# Altium schematic sheet Sheet1.SchDoc
size A2
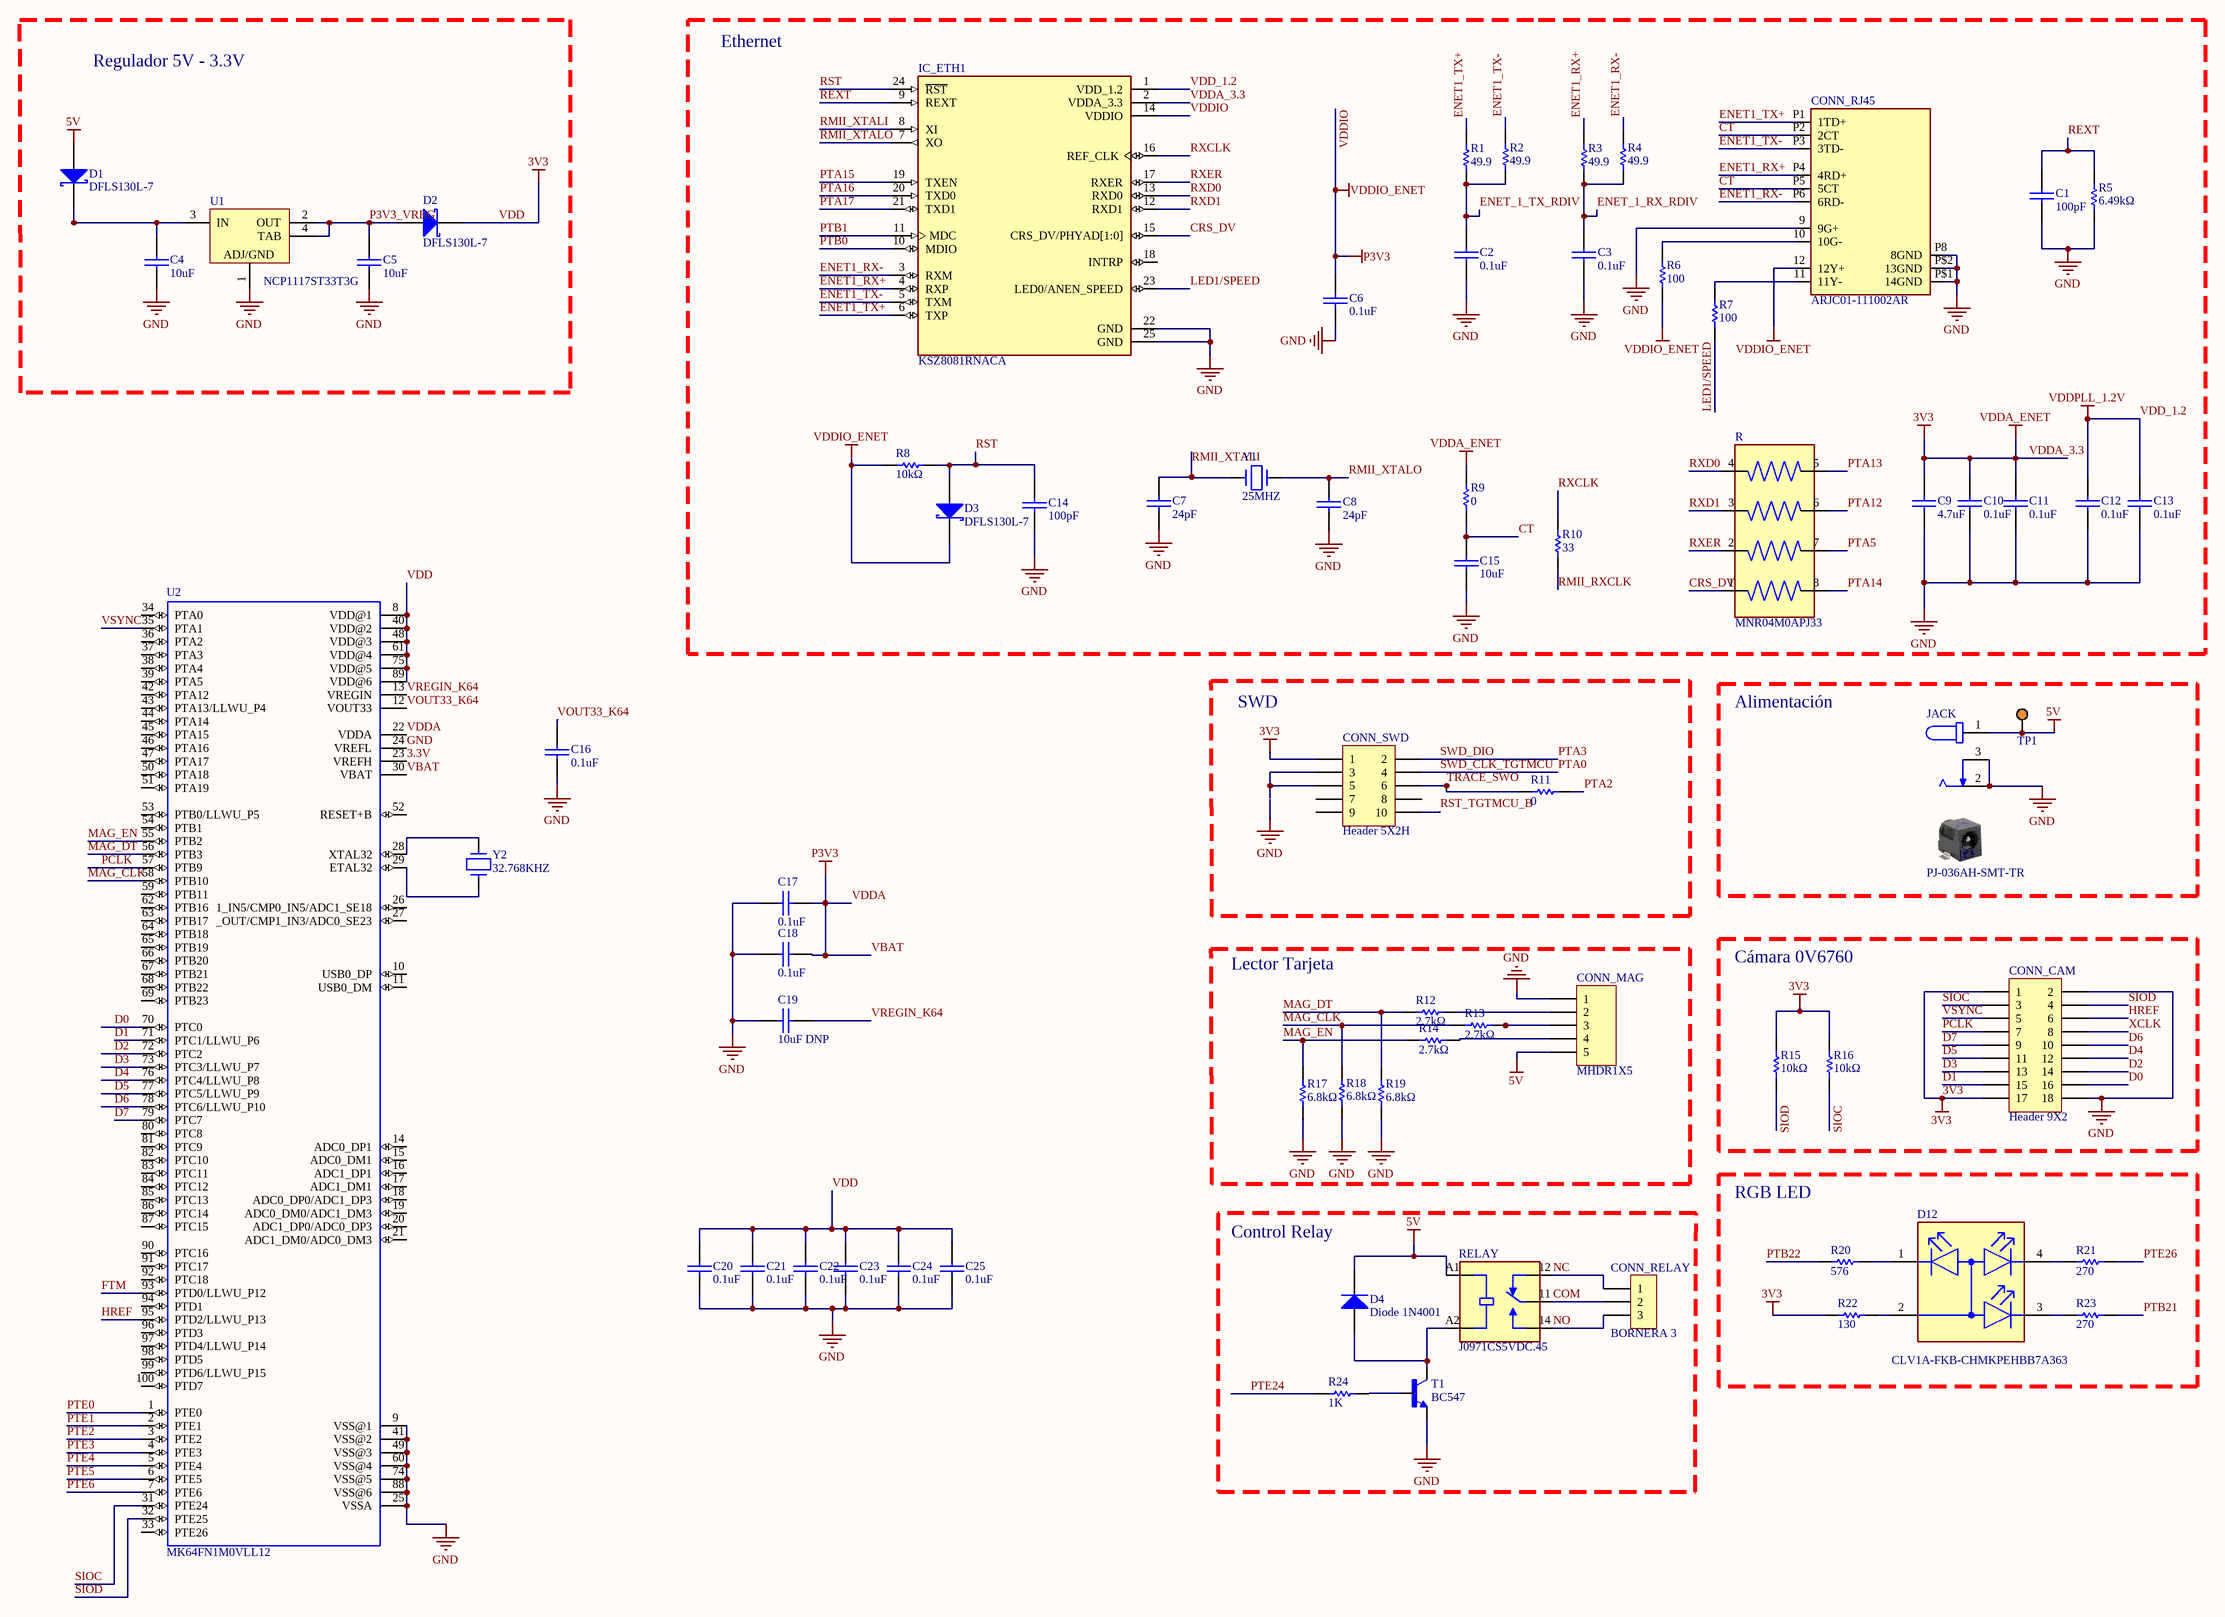
[diagram p0: Sheet1.SchDoc]

## Parts
C1  100pF  [0805]
C2  0.1uF  [0805]
C3  0.1uF  [0805]
C4  10uF  [0805]
C5  10uF  [0805]
C6  0.1uF  [0805]
C7  24pF  [0805]
C8  24pF  [0805]
C9  4.7uF  [0805]
C10  0.1uF  [0805]
C11  0.1uF  [0805]
C12  0.1uF  [0805]
C13  0.1uF  [0805]
C14  100pF  [0805]
C15  10uF  [0805]
C16  0.1uF  [1206]
C17  0.1uF  [0805]
C18  0.1uF  [0805]
C19  10uF DNP  [1206]
C20  0.1uF  [0805]
C21  0.1uF  [0805]
C22  0.1uF  [0805]
C23  0.1uF  [0805]
C24  0.1uF  [0805]
C25  0.1uF  [0805]
CONN_CAM  Header 9X2  [HDR2X9]
CONN_MAG  MHDR1X5  [MHDR1X5]
CONN_RELAY  BORNERA 3  [BORNERA3]
CONN_RJ45  ARJC01-111002AR  [ARJC01-111002AR]
CONN_SWD  Header 5X2H  [HDR2X5H]
D1  DFLS130L-7  [DIOD-POWERDI123-2_A_V]
D2  DFLS130L-7  [DIOD-POWERDI123-2_A_V]
D3  DFLS130L-7  [DIOD-POWERDI123-2_A_V]
D4  Diode 1N4001  [DO-41]
D12  CLV1A-FKB-CHMKPEHBB7A363  [FP-CLV1A-FKB-CHMKPEHBB7A3-MFG]
IC_ETH1  KSZ8081RNACA  [QFN50P400X400X90-25N]
JACK  Manufacturer Part Number: PJ-036AH-SMT-TR  [CUI_PJ-036AH-SMT-TR]  (hidden comment: CONN_JACKDC_SMD_PJ-036AH-SMT-TR)
R  MNR04M0APJ33  [RESCAXS50P200X100X45-8N]
R1  49.9  [0805]
R2  49.9  [0805]
R3  49.9  [0805]
R4  49.9  [0805]
R5  Power: 6.49kΩ  [RES_0603]  (hidden comment: RES_10k_SMD_RMCF0603FT10K0)
R6  100  [0805]
R7  100  [0805]
R8  Power: 10kΩ  [RES_0603]  (hidden comment: RES_10k_SMD_RMCF0603FT10K0)
R9  0  [0805]
R10  Power: 33  [RES_0603]  (hidden comment: RES_10k_SMD_RMCF0603FT10K0)
R11  Power: 0  [RES_0603]  (hidden comment: RES_10k_SMD_RMCF0603FT10K0)
R12  Power: 2.7kΩ  [RES_0603]  (hidden comment: RES_10k_SMD_RMCF0603FT10K0)
R13  Power: 2.7kΩ  [RES_0603]  (hidden comment: RES_10k_SMD_RMCF0603FT10K0)
R14  Power: 2.7kΩ  [RES_0603]  (hidden comment: RES_10k_SMD_RMCF0603FT10K0)
R15  Power: 10kΩ  [RES_0603]  (hidden comment: RES_10k_SMD_RMCF0603FT10K0)
R16  Power: 10kΩ  [RES_0603]  (hidden comment: RES_10k_SMD_RMCF0603FT10K0)
R17  Power: 6.8kΩ  [RES_0603]  (hidden comment: RES_10k_SMD_RMCF0603FT10K0)
R18  Power: 6.8kΩ  [RES_0603]  (hidden comment: RES_10k_SMD_RMCF0603FT10K0)
R19  Power: 6.8kΩ  [RES_0603]  (hidden comment: RES_10k_SMD_RMCF0603FT10K0)
R20  Power: 576  [RES_0603]  (hidden comment: RES_10k_SMD_RMCF0603FT10K0)
R21  Power: 270  [RES_0603]  (hidden comment: RES_10k_SMD_RMCF0603FT10K0)
R22  Power: 130  [RES_0603]  (hidden comment: RES_10k_SMD_RMCF0603FT10K0)
R23  Power: 270  [RES_0603]  (hidden comment: RES_10k_SMD_RMCF0603FT10K0)
R24  1K  [0805]
RELAY  J0971CS5VDC.45  [RELAY_J0971CS5VDC.45]
T1  BC547  [TO92]
TP1  MISC_TESTPOINT  [TP_SIGNAL]  (value not drawn)  (no BOM)
U1  NCP1117ST33T3G  [ONSC-SOT-223-4-318H-01_A_V]
U2  MK64FN1M0VLL12  [QFP50P1600X1600X170-100N]
Y1  25MHZ  [CRISTAL PERFIL]
Y2  32.768KHZ  [CRISTAL PERFIL]

## Blocks framed on the sheet
Regulador 5V - 3.3V: C4 C5 D1 D2 U1
Ethernet: C1-C3 C6-C15 CONN_RJ45 D3 IC_ETH1 R R1-R10 Y1
SWD: CONN_SWD R11
Alimentación: JACK TP1
Lector Tarjeta: CONN_MAG R12-R14 R17-R19
Cámara 0V6760: CONN_CAM R15 R16
RGB LED: D12 R20-R23
Control Relay: CONN_RELAY D4 R24 RELAY T1

## Nets
3V3: C9.1 C10.1 C11.1 C20.2 C21.2 C22.2 C23.2 C24.2 C25.2 CONN_CAM.1 CONN_CAM.17 CONN_SWD.1 D2.2(K) IC_ETH1.2(VDDA_3.3) R9.2 R15.2 R16.2 R22.2 U2.8(VDD@1) U2.40(VDD@2) U2.48(VDD@3) U2.61(VDD@4) U2.75(VDD@5) U2.89(VDD@6)  [also labelled VDD, VDDA_3.3, VDDA_ENET]
5V: CONN_MAG.5 D1.1(A) D4.2(K) JACK.1 RELAY.A1(COIL1) TP1.1
GND: C1.2 C2.1 C3.1 C4.2 C5.2 C6.1 C7.2 C8.2 C9.2 C10.2 C11.2 C12.2 C13.2 C14.1 C15.1 C16.1 C17.1 C18.1 C19.2 C20.1 C21.1 C22.1 C23.1 C24.1 C25.1 CONN_CAM.2 CONN_CAM.18 CONN_MAG.1 CONN_RJ45.9(9G+) CONN_RJ45.P8(8GND) CONN_RJ45.P$1(14GND) CONN_RJ45.P$2(13GND) IC_ETH1.22(GND) IC_ETH1.25(GND) JACK.2 JACK.3 R5.2 R17.2 R18.2 R19.2 T1.1(E) U1.1(ADJ/GND) U2.9(VSS@1) U2.24(VREFL) U2.25(VSSA) U2.41(VSS@2) U2.49(VSS@3) U2.60(VSS@4) U2.74(VSS@5) U2.88(VSS@6)
VBAT: C6.2 C17.2 C18.2 CONN_RJ45.12(12Y+) D3.2(K) IC_ETH1.14(VDDIO) R6.1 R8.2 U2.22(VDDA) U2.30(VBAT)  [also labelled P3V3, VDDA, VDDIO, VDDIO_ENET]
VDD_1.2: C12.1 C13.1 IC_ETH1.1(VDD_1.2)  [also labelled VDDPLL_1.2V]
3.3V: U2.23(VREFH)
COM: CONN_RELAY.2 RELAY.11(COM)
CRS_DV: IC_ETH1.15(CRS_DV/PHYAD[1:0]) R.1
CT: C15.2 CONN_RJ45.P2(2CT) CONN_RJ45.P5(5CT) R9.1
D0: CONN_CAM.16 U2.70(PTC0)
D1: CONN_CAM.15 U2.71(PTC1/LLWU_P6)
D2: CONN_CAM.14 U2.72(PTC2)
D3: CONN_CAM.13 U2.73(PTC3/LLWU_P7)
D4: CONN_CAM.12 U2.76(PTC4/LLWU_P8)
D5: CONN_CAM.11 U2.77(PTC5/LLWU_P9)
D6: CONN_CAM.10 U2.78(PTC6/LLWU_P10)
D7: CONN_CAM.9 U2.79(PTC7)
ENET1_RX+: CONN_RJ45.P4(4RD+) IC_ETH1.4(RXP) R3.2
ENET1_RX-: CONN_RJ45.P6(6RD-) IC_ETH1.3(RXM) R4.2
ENET1_TX+: CONN_RJ45.P1(1TD+) IC_ETH1.6(TXP) R1.2
ENET1_TX-: CONN_RJ45.P3(3TD-) IC_ETH1.5(TXM) R2.2
ENET_1_RX_RDIV: C3.2 R3.1 R4.1
ENET_1_TX_RDIV: C2.2 R1.1 R2.1
FTM: U2.93(PTD0/LLWU_P12)
HREF: CONN_CAM.6 U2.95(PTD2/LLWU_P13)
LED1/SPEED: IC_ETH1.23(LED0/ANEN_SPEED) R7.1
MAG_CLK: R13.2 R18.1 U2.58(PTB10)
MAG_DT: R12.2 R19.1 U2.56(PTB3)
MAG_EN: R14.1 R17.1 U2.55(PTB2)
NC: CONN_RELAY.1 RELAY.12(NC)
NO: CONN_RELAY.3 RELAY.14(NO)
P3V3_VREG: C5.1 D2.1(A) U1.2(OUT) U1.4(TAB)
PCLK: CONN_CAM.7 U2.57(PTB9)
PTA0: CONN_SWD.4  [also labelled SWD_CLK_TGTMCU]
PTA2: R11.1
PTA3: CONN_SWD.2  [also labelled SWD_DIO]
PTA5: R.7
PTA12: R.6
PTA13: R.5
PTA14: R.8
PTA15: IC_ETH1.19(TXEN)
PTA16: IC_ETH1.20(TXD0)
PTA17: IC_ETH1.21(TXD1)
PTB0: IC_ETH1.10(MDIO)
PTB1: IC_ETH1.11(MDC)
PTB21: R23.2
PTB22: R20.2
PTE0: U2.1(PTE0)
PTE1: U2.2(PTE1)
PTE2: U2.3(PTE2)
PTE3: U2.4(PTE3)
PTE4: U2.5(PTE4)
PTE5: U2.6(PTE5)
PTE6: U2.7(PTE6)
PTE24: R24.2
PTE26: R21.2
REXT: C1.1 IC_ETH1.9(REXT) R5.1
RMII_RXCLK: R10.2
RMII_XTALI: C7.1 IC_ETH1.8(XI) Y1.2
RMII_XTALO: C8.1 IC_ETH1.7(XO) Y1.1
RST: C14.2 D3.1(A) IC_ETH1.24(~{RST}) R8.1
RST_TGTMCU_B: CONN_SWD.10
RXCLK: IC_ETH1.16(REF_CLK) R10.1
RXD0: IC_ETH1.13(RXD0) R.4
RXD1: IC_ETH1.12(RXD1) R.3
RXER: IC_ETH1.17(RXER) R.2
SIOC: CONN_CAM.3 R16.1 U2.31(PTE24)
SIOD: CONN_CAM.4 R15.1 U2.32(PTE25)
TRACE_SWO: CONN_SWD.6 R11.2
VOUT33_K64: C16.2 U2.12(VOUT33)
VREGIN_K64: C19.1 U2.13(VREGIN)
VSYNC: CONN_CAM.5 U2.35(PTA1)
XCLK: CONN_CAM.8
NetC4_1: C4.1 D1.2(K) U1.3(IN)
NetCONN_MAG_2: CONN_MAG.2 R12.1
NetCONN_MAG_3: CONN_MAG.3 R13.1
NetCONN_MAG_4: CONN_MAG.4 R14.2
NetCONN_RJ45_10: CONN_RJ45.10(10G-) R6.2
NetCONN_RJ45_11: CONN_RJ45.11(11Y-) R7.2
NetCONN_SWD_3: CONN_SWD.3 CONN_SWD.5
NetD4_1: D4.1(A) RELAY.A2(COIL2) T1.3(C)
NetD12_1: D12.1(RED(C)) R20.1
NetD12_2: D12.2(COMMON_ANODE) R22.1
NetD12_3: D12.3(BLUE(C)) R23.1
NetD12_4: D12.4(GREEN(C)) R21.1
NetR24_1: R24.1 T1.2(B)
NetU2_28: U2.28(XTAL32) Y2.2
NetU2_29: U2.29(ETAL32) Y2.1

Not connected (* = marked no-connect by the designer): CONN_SWD 7 8 9; IC_ETH1 18(INTRP); U2 10(USB0_DP) 11(USB0_DM) 14(ADC0_DP1) 15(ADC0_DM1) 16(ADC1_DP1) 17(ADC1_DM1) 18(ADC0_DP0/ADC1_DP3) 19(ADC0_DM0/ADC1_DM3) 20(ADC1_DP0/ADC0_DP3) 21(ADC1_DM0/ADC0_DM3) 26(1_IN5/CMP0_IN5/ADC1_SE18) 27(_OUT/CMP1_IN3/ADC0_SE23) 33(PTE26) 34(PTA0) 36(PTA2) 37(PTA3) 38(PTA4) 39(PTA5) 42(PTA12) 43(PTA13/LLWU_P4) 44(PTA14) 45(PTA15) 46(PTA16) 47(PTA17) 50(PTA18) 51(PTA19) 52(RESET+B) 53(PTB0/LLWU_P5) 54(PTB1) 59(PTB11) 62(PTB16) 63(PTB17) 64(PTB18) 65(PTB19) 66(PTB20) 67(PTB21) 68(PTB22) 69(PTB23) 80(PTC8) 81(PTC9) 82(PTC10) 83(PTC11) 84(PTC12) 85(PTC13) 86(PTC14) 87(PTC15) 90(PTC16) 91(PTC17) 92(PTC18) 94(PTD1) 96(PTD3) 97(PTD4/LLWU_P14) 98(PTD5) 99(PTD6/LLWU_P15) 100(PTD7)

## Library data of the parts
C1-C25 = CAP
CONN_CAM = Header 9X2: Header, 9-Pin, Dual row; LatestRevisionDate: 17-Jul-2002; LatestRevisionNote: Re-released for DXP Platform.; Publisher: Altium Limited
CONN_MAG = MHDR1X5: Header, 5-Pin; LatestRevisionDate: 17-Jul-2002; LatestRevisionNote: Re-released for DXP Platform.; Publisher: Altium Limited
CONN_RJ45 = ARJC01-111002AR: 1 Port RJ45 Magjack Connector Through Hole 10/100 Base-TX, AutoMDIX; MF: Abracon LLC; Package: None; Availability: Unavailable; MP: ARJC01-111002AR; Value: *; SnapEDA_Link: https://www.snapeda.com/parts/ARJC01-111002AR/Abracon%20LLC/view-part/586362/?ref=snap; Price: None
CONN_SWD = Header 5X2H: Header, 5-Pin, Dual row, Right Angle; LatestRevisionDate: 17-Jul-2002; LatestRevisionNote: Re-released for DXP Platform.; Publisher: Altium Limited
D1-D3 = CMP-2000-07448-1: Schottky Barrier Rectifier, 30 V, 1 A, -40 to 125 degC, 2-Pin SMD, RoHS, Tape and Reel; Manufacturer: Diodes Inc; Max Repetitive Reverse Voltage (Vrrm): 30V; Polarity: Standard; Average Rectified Current: 1A; Element Configuration: Single; Forward Voltage: 360mV; Peak Non-Repetitive Surge Current: 50A; Max Power Dissipation: 1.67W; Case\/Package: SMD/SMT; Capacitance: 76pF; Peak Reverse Current: 1mA; Datasheet URL: https://www.diodes.com/assets/Datasheets/ds30492.pdf; Package Quantity: 3000; Reverse Voltage (DC): 30V; Package Reference: POWERDI123-2_A; Lead Free: LeadFree; Mounting Technology: SurfaceMount; Max Operating Temperature: 125degC; Current Rating: 1A; Radiation Hardening: No; Width: 1.78mm; Height: 0.98mm; Output Current: 1A; Contact Plating: Matte; Length: 2.8mm; Number of Pins: 2; Voltage Rating (DC): 30V; RoHSCompliant: true; Termination: SMD/SMT; Forward Current: 1A; Min Operating Temperature: -40degC; Datasheet Version: Rev. 4-2, 06/2009; Packaging: TapeandReel; REACH SVHC: NoSVHC; Max Forward Surge Current (Ifsm): 50A; Manufacturer URL: http://www.diodes.com/; Mount: SurfaceMount; Package Description: 2-Pin Small Outline Diode, Body 2.8 x 1.78 mm
D4 = Diode 1N4001: 1 Amp General Purpose Rectifier; Published: 8-Jun-2000; LatestRevisionDate: 17-Jul-2002; LatestRevisionNote: Re-released for DXP Platform.; DatasheetVersion: 1998; PackageVersion: Aug-1999; PackageReference: DO-41; Publisher: Altium Limited; PackageDescription: Diode, Axial; Body 5.2 x 2.7 mm (LxDia. max), Lead Dia. 0.86 mm (max); Code_JEDEC: DO-204-AL; ComponentLink1Description: Manufacturer Link; ComponentLink1URL: http://www.fairchildsemi.com/; ComponentLink2Description: Datasheet; ComponentLink2URL: http://www.fairchildsemi.com/ds/1N%2F1N4001.pdf
D12 = CMP-13977-000017-1: LED RGB 4PLCC SMD; Lens Color: White; Number of Elements: 3; Dominant Wavelength: 470nm; Forward Voltage: 3.2V; Luminous Intensity: 315mcd; Lens Style: Round; Viewing Angle: 120°; Number of LEDs: 1; Test Current: 20mA; Lens Transparency: Diffused; Reverse Voltage: 5V; Color: Blue; Height: 2.1mm; Package Quantity: 2000; Length: 2.8mm; Number of Pins: 4; Packaging: Tape and Reel; Width: 2.8mm; Radiation Hardening: No; Depth: 3.2mm; Mount: Surface Mount; Min Operating Temperature: -40°C; Forward Current: 20mA; Max Operating Temperature: 100°C; Case/Package: PLCC
IC_ETH1 = KSZ8081RNACA: 1/1 Transceiver Full RMII 24-QFN _4x4_; MF: Microchip; Price: None; Package: QFN-24 Microchip; Availability: Unavailable; SnapEDA_Link: https://www.snapeda.com/parts/KSZ8081RNACA/Microchip/view-part/554387/?ref=snap; Value: *; MP: KSZ8081RNACA
JACK = CONN_JACKDC_SMD_PJ-036AH-SMT-TR: CONN PWR JACK 2X5.5MM SOLDER; Manufacturer: CUI Devices; Package: Nonstandard
R = MNR04M0APJ334: Res Array 330K Ohm 5% Â±200ppm/Â°C ISOL Epoxy 8-Pin 0804(4 X 0402) Convex SMD Automotive T/R; MF: Rohm; Price: None; SnapEDA_Link: https://www.snapeda.com/parts/MNR04M0APJ334/Rohm/view-part/472925/?ref=snap; MP: MNR04M0APJ334; Availability: Unavailable; Value: *; Package: 0402 Rohm
R1-R4 R6 R7 R9 R24 = RES
R5 R8 R10-R23 = RES_10k_SMD_RMCF0603FT10K0: RES 10K OHM 1% 1/10W 0603; Manufacturer: Stackpole Electronics Inc; Value: 10kΩ; Manufacturer Part Number: RMCF0603FT10K0; Package: 0603
RELAY = J0971CS5VDC.45: General Purpose Relay SPDT (1 Form C) 5VDC Coil Through Hole; MF: CIT Relay and Switch; SnapEDA_Link: https://www.snapeda.com/parts/J0971CS5VDC.45/CIT%20Relay%20&%20Switch/view-part/5164607/?ref=snap; MP: J0971CS5VDC.45; Availability: Warning; Price: None; Check_prices: https://www.snapeda.com/parts/J0971CS5VDC.45/CIT%20Relay%20&%20Switch/view-part/5164607/?ref=eda; Value: *; Purchase-URL: https://pricing.snapeda.com/search/part/J0971CS5VDC.45/?ref=eda; Package: None
T1 = BC547: Trans GP BJT NPN 45V 0.1A 500mW 3-Pin TO-92 T/R; MF: ON Semiconductor; Package: None; MP: BC547; Check_prices: https://www.snapeda.com/parts/BC547/Onsemi/view-part/?ref=eda; Value: *; SnapEDA_Link: https://www.snapeda.com/parts/BC547/Onsemi/view-part/?ref=snap; Availability: In Stock; Price: None; Purchase-URL: https://pricing.snapeda.com/search/part/BC547/?ref=eda
TP1 = MISC_TP: TESTPOINT; Manufacturer: *; Manufacturer Part Number: *; Footprint: *
U1 = CMP-1679-00010-1: Low-Dropout Positive Fixed Voltage Regulator, 1 A, 3.3 V Output Voltage, 0 to 125 degC, 4-Pin SOT-223 (318H-01), Pb-Free, Tape and Reel; Resistance: 220 kohm; Type (Resistor): Thick Film; Voltage Rating: 75 V; Tolerance: 1%; Case\Package: 0603; Power Rating: 100 mW; Width: 0.85 mm; Weight: 7.1E-05 oz; ComponentLink2URL: http://www.onsemi.com/pub_link/Collateral/NCP1117-D.PDF; RoHSCompliant: true; Height: 0.45 mm; PackageDescription: 4-Pin Small Outline Transistor, Body 6.5 x 3.5 mm, Pitch 2.3 mm; ComponentLink1Description: Manufacturer URL; ComponentLink1URL: http://www.onsemi.com/; PackageReference: SOT-223-4-318H-01_A; Max Operating Temperature: 155 degC; Packaging: Tape and Reel; REACH SVHC: Unknown; Length: 1.55 mm; Package Quantity: 5000; Radiation Hardening: No; Min Operating Temperature: -55 degC; DatasheetVersion: Rev. 27, 09/2014; Mount: Surface Mount; Case Code (Imperial): 0603; Case Code (Metric): 1608; ComponentLink2Description: Datasheet
U2 = MK64FN1M0VLL12: ARMÂ® CortexÂ®-M4 Kinetis K60 Microcontroller IC 32-Bit 120MHz 1MB _1M x 8_ FLASH 100-LQFP _14x14_; MF: NXP USA; Package: LQFP-100 NXP Semiconductors; MP: MK64FN1M0VLL12; SnapEDA_Link: https://www.snapeda.com/parts/MK64FN1M0VLL12/NXP%20USA%20Inc./view-part/454279/?ref=snap; Value: *; Availability: Unavailable; Price: None
Y1 Y2 = CRISTAL